# EAGLE schematic 2d (EAGLE 6.4)
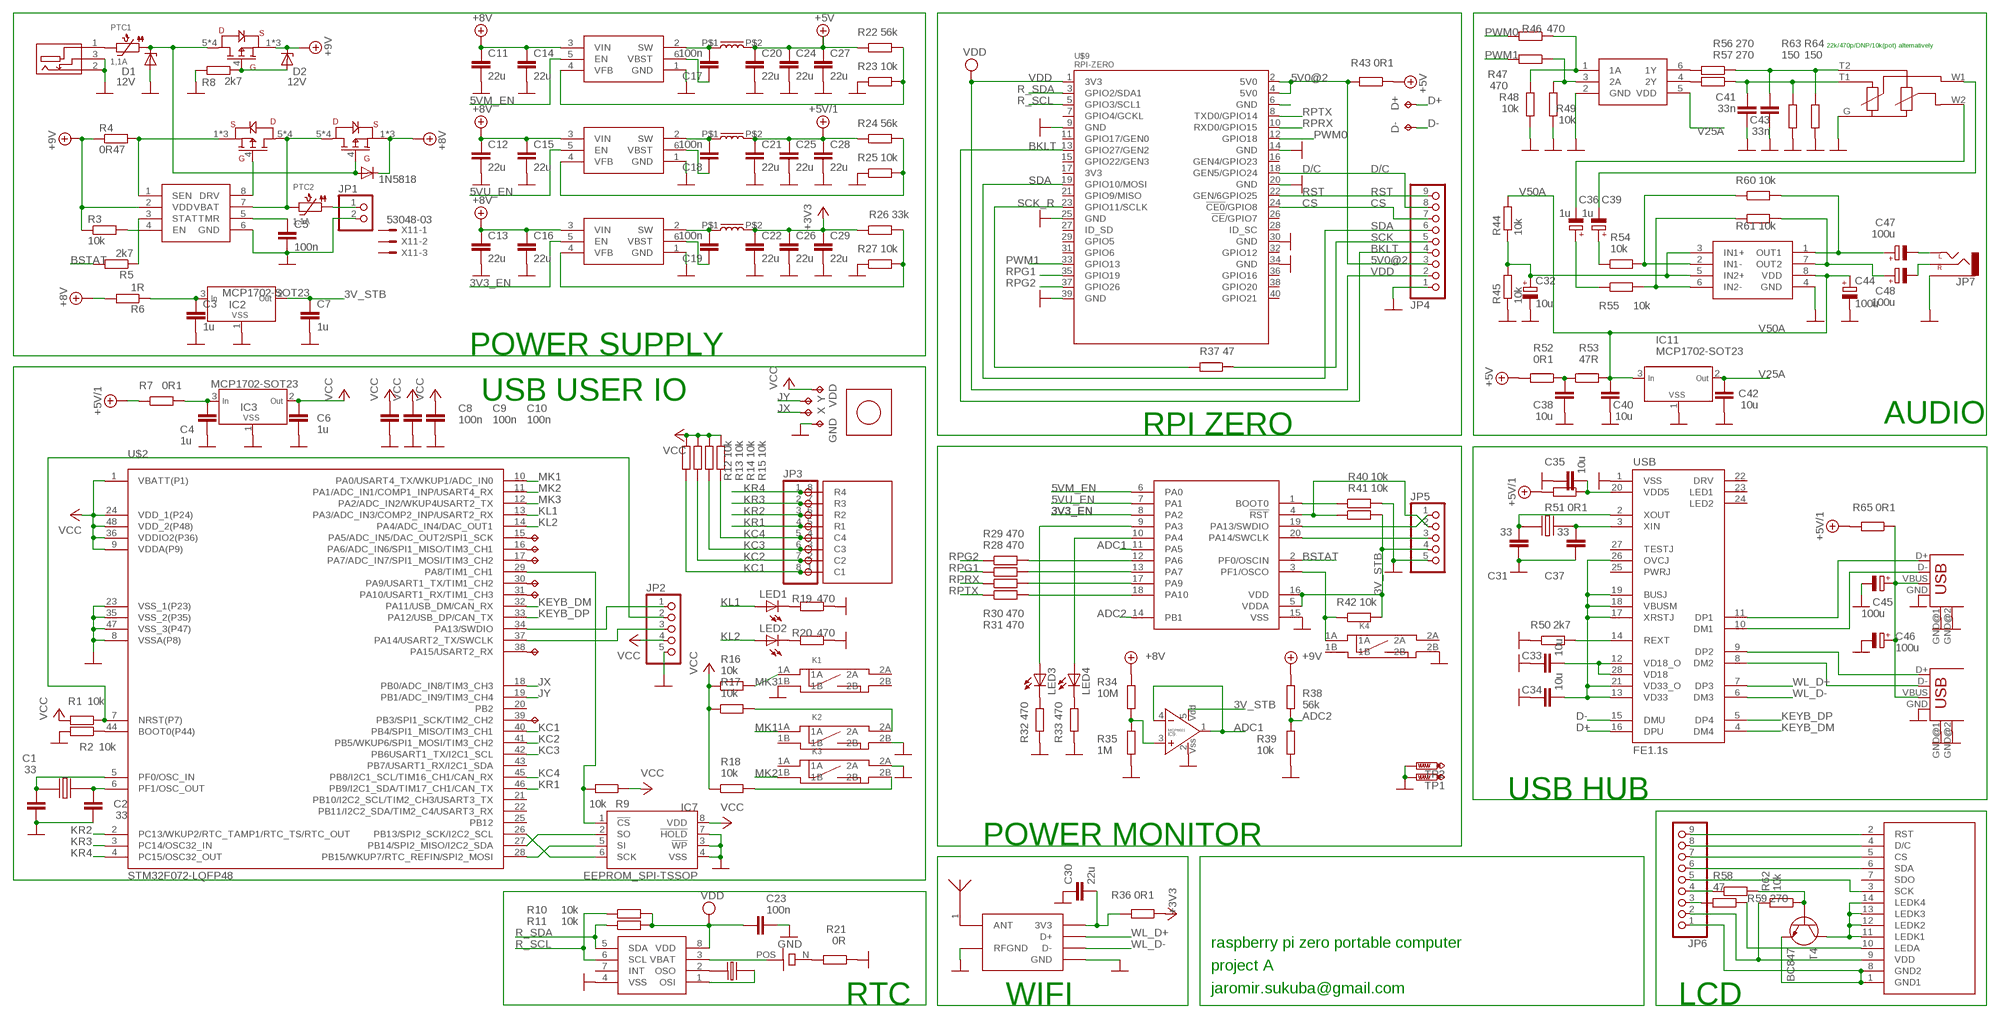
[diagram p0: schematic, sheet 1]

## Parts
ANT1  ANT_RAINSUN_24GHZ  [ANT_RAINSUN-24G]
C1  33  C_0806  [R0805]
C2  33  C_0806  [R0805]
C3  1u  C_0806  [R0805]
C4  1u  C_0806  [R0805]
C5  100n  C_0806  [R0805]
C6  1u  C_0806  [R0805]
C7  1u  C_0806  [R0805]
C8  100n  C_0806  [R0805]
C9  100n  C_0806  [R0805]
C10  100n  C_0806  [R0805]
C11  22u  C_0806  [R0805]
C12  22u  C_0806  [R0805]
C13  22u  C_0806  [R0805]
C14  22u  C_0806  [R0805]
C15  22u  C_0806  [R0805]
C16  22u  C_0806  [R0805]
C17  100n  C_0806  [R0805]
C18  100n  C_0806  [R0805]
C19  100n  C_0806  [R0805]
C20  22u  C_0806  [R0805]
C21  22u  C_0806  [R0805]
C22  22u  C_0806  [R0805]
C23  100n  C_0806  [R0805]
C24  22u  C_0806  [R0805]
C25  22u  C_0806  [R0805]
C26  22u  C_0806  [R0805]
C27  22u  C_0806  [R0805]
C28  22u  C_0806  [R0805]
C29  22u  C_0806  [R0805]
C30  22u  C_0806  [R0805]
C31  33  C_0806  [R0805]
C32  10u  CPOL-EUB  [PANASONIC_B]
C33  10u  C_0806  [R0805]
C34  10u  C_0806  [R0805]
C35  10u  C_0806  [R0805]
C36  1u  CPOL-EUA  [PANASONIC_A]
C37  33  C_0806  [R0805]
C38  10u  C_0806  [R0805]
C39  1u  CPOL-EUA  [PANASONIC_A]
C40  10u  C_0806  [R0805]
C41  33n  C_0806  [R0805]
C42  10u  C_0806  [R0805]
C43  33n  C_0806  [R0805]
C44  100u  CPOL-EUD  [PANASONIC_D]
C45  100u  CPOL-EUD  [PANASONIC_D]
C46  100u  CPOL-EUD  [PANASONIC_D]
C47  100u  CPOL-EUD  [PANASONIC_D]
C48  100u  CPOL-EUD  [PANASONIC_D]
D1  12V  ZENER-DIODESMB  [SMB]
D2  12V  ZENER-DIODESOD80C  [SOD80C]
D3  1N5818  DIODE-SMB  [SMB]
D+  TPTP14R  [TP14R]
D-  TPTP14R  [TP14R]
GND  TPTP14R  [TP14R]
IC1  MCP73844  [MSOP8]
IC2  MCP1702-SOT23  [SOT23]
IC3  MCP1702-SOT23  [SOT23]
IC4  TPS562200  [SOT23-6]
IC5  TPS562200  [SOT23-6]
IC6  TPS562200  [SOT23-6]
IC7  EEPROM_SPI-TSSOP  [TSSOP8W]
IC8  PCF8523  [SO-08]
IC9  MCP6021  [SOT23-5L]
IC10  74LVC2G34  [SOT23-6]
IC11  MCP1702-SOT23  [SOT23]
JP1  PINHD-1X02_2.54-90°  [1X02/90]
JP2  PINHD-1X05_2.54-90°  [1X05/90]
JP3  PINHD-1X08_2.54  [1X08]
JP4  PINHD-1X09_2.00  [1X09M]
JP5  PINHD-1X05_2.54-90°  [1X05/90]
JP6  PINHD-1X09_2.00  [1X09M]
JP7  AUDIO-JACKPTH  [AUDIO-JACK]
K1  SWITCH_BD_B  [SW_SMD2]
K2  SWITCH_BD_B  [SW_SMD2]
K3  SWITCH_BD_B  [SW_SMD2]
K4  SWITCH_BD_B  [SW_SMD2]
LED1  LED3MM  [LED3MM]
LED2  LED3MM  [LED3MM]
LED3  LED3MM  [LED3MM]
LED4  LED3MM  [LED3MM]
MOD1  MOD_USB_RTL8188  [MOD_USB_RTL8188]
PTC1  1,1A  PTC1812  [PTC1812]
PTC2  1,1A  PTC1812  [PTC1812]
Q1  CRYSTAL87X38  [CRYST_32K_87X38MM]
R1  10k  R_0805  [R0805]
R2  10k  R_0805  [R0805]
R3  10k  R_0805  [R0805]
R4  0R47  R_1206  [R1206]
R5  2k7  R_0805  [R0805]
R6  1R  R_0805  [R0805]
R7  0R1  R_1206  [R1206]
R8  2k7  R_0805  [R0805]
R9  10k  R_0805  [R0805]
R10  10k  R_0805  [R0805]
R11  10k  R_0805  [R0805]
R12  10k  R_0805  [R0805]
R13  10k  R_0805  [R0805]
R14  10k  R_0805  [R0805]
R15  10k  R_0805  [R0805]
R16  10k  R_0805  [R0805]
R17  10k  R_0805  [R0805]
R18  10k  R_0805  [R0805]
R19  470  R_0805  [R0805]
R20  470  R_0805  [R0805]
R21  0R  R_0805  [R0805]
R22  56k  R_0805  [R0805]
R23  10k  R_0805  [R0805]
R24  56k  R_0805  [R0805]
R25  10k  R_0805  [R0805]
R26  33k  R_0805  [R0805]
R27  10k  R_0805  [R0805]
R28  470  R_0805  [R0805]
R29  470  R_0805  [R0805]
R30  470  R_0805  [R0805]
R31  470  R_0805  [R0805]
R32  470  R_0805  [R0805]
R33  470  R_0805  [R0805]
R34  10M  R_0805  [R0805]
R35  1M  R_0805  [R0805]
R36  0R1  R_1206  [R1206]
R37  47  R_0805  [R0805]
R38  56k  R_0805  [R0805]
R39  10k  R_0805  [R0805]
R40  10k  R_0805  [R0805]
R41  10k  R_0805  [R0805]
R42  10k  R_0805  [R0805]
R43  0R1  R_1206  [R1206]
R44  10k  R_0805  [R0805]
R45  10k  R_0805  [R0805]
R46  470  R_0805  [R0805]
R47  470  R_0805  [R0805]
R48  10k  R_0805  [R0805]
R49  10k  R_0805  [R0805]
R50  2k7  R_0805  [R0805]
R51  0R1  R_1206  [R1206]
R52  0R1  R_1206  [R1206]
R53  47R  R_0805  [R0805]
R54  10k  R_0805  [R0805]
R55  10k  R_0805  [R0805]
R56  270  R_0805  [R0805]
R57  270  R_0805  [R0805]
R58  47  R_0805  [R0805]
R59  270  R_0805  [R0805]
R60  10k  R_0805  [R0805]
R61  10k  R_0805  [R0805]
R62  10k  R_0805  [R0805]
R63  150  R_0805  [R0805]
R64  150  R_0805  [R0805]
R65  0R1  R_1206  [R1206]
T1  PFET_SO8  [SO-08]
T2  PFET_SO8  [SO-08]
T3  PFET_SO8  [SO-08]
T4  BC847  [SOT23]
TFT1  DISP_ILI_28  [DISP_ILI_28]
TP1  PTR1PAD1-13  [P1-13]
TP2  PTR1PAD1-13  [P1-13]
U$1  CONN_DC_13  [CON_DC13]
U$2  STM32F072-LQFP48  [LQFP48]
U$3  2u2  INDUCTORBOURNS_SRP7030  [BOURNS_SRP7030]
U$4  2u2  INDUCTORBOURNS_SRP7030  [BOURNS_SRP7030]
U$5  2u2  INDUCTORBOURNS_SRP7030  [BOURNS_SRP7030]
U$6  BATTH1220  [BATT_HOLDER_DS1092-12]
U$7  KB1604  [KB1604]
U$8  JOY_PS  [JOY_PS]
U$9  RPI-ZERO  [RASPBERRYPI_BASTELSTUBE_V13_RASPI_BOARD_B+_FULL]
U$10  STM32F030_20  [TSSOP20]
U$11  TDA1308  [SO-08]
U$12  POT_DUAL_14X2  [POT_14X2DUAL]
USB  FE1.1S  [FE1.1S_SSOP-28]
USB1  USB-A-S  [USB-A-S]
USB2  USB-A-S  [USB-A-S]
VDD  TPTP14R  [TP14R]
X  TPTP14R  [TP14R]
X1  CRYST_TC26SMXAS  [CR_12SMXA_S]
X2  TPTP14R  [TP14R]
X3  TPTP14R  [TP14R]
X4  TPTP14R  [TP14R]
X5  TPTP14R  [TP14R]
X6  TPTP14R  [TP14R]
X7  TPTP14R  [TP14R]
X8  TPTP14R  [TP14R]
X9  CRYST_TC26SMXAS  [CR_12SMXA_S]
X11  53048-03  [53048-03]
Y  TPTP14R  [TP14R]

## Nets
3V3_EN: IC6.5(EN) U$10.8(PA2)
3V_STB: C7.1 IC2.2(OUT) IC9.5(VDD) JP5.4 R41.2 R42.2 U$10.5(VDDA) U$10.16(VDD)
5V0@2: JP4.3 R43.2 U$9.2(5V0) U$9.4(5V0)
5VM_EN: IC4.5(EN) U$10.6(PA0)
5VU_EN: IC5.5(EN) U$10.7(PA1)
+3V3: C22.1 C26.1 C29.1 R26.1 R36.1 U$5.P$2
+5V: C20.1 C24.1 C27.1 R22.1 R43.1 R52.2 U$3.P$2
+5V/1: C21.1 C25.1 C28.1 R7.1 R24.1 R51.2 R65.2 U$4.P$2
+8V: C11.1 C12.1 C13.1 C14.1 C15.1 C16.1 D3.C IC4.3(VIN) IC5.3(VIN) IC6.3(VIN) R6.2 R34.2 T3.1(S) T3.2(S) T3.3(S)
+12V: D2.C IC1.2(VDD) R3.1 R4.1 R38.2 T1.1(S) T1.2(S) T1.3(S) ; supply symbol labelled +9V
ADC1: IC9.1(.:VYSTUP) IC9.4(.:IN-) U$10.11(PA5)
ADC2: R38.1 R39.2 U$10.14(PB1)
BKLT: JP4.4 U$9.13(GPIO27/GEN2)
BSTAT: R5.2 U$10.2(PF0/OSCIN)
CS: JP4.7 U$9.24(!CE0!/GPIO8)
D+: D+.TP USB.16(DPU)
D-: D-.TP USB.15(DMU)
D/C: JP4.8 U$9.18(GEN5/GPIO24)
GND: C1.1 C2.1 C3.2 C4.2 C5.2 C6.2 C7.2 C8.2 C9.2 C10.2 C11.2 C12.2 C13.2 C14.2 C15.2 C16.2 C20.2 C21.2 C22.2 C23.2 C24.2 C25.2 C26.2 C27.2 C28.2 C29.2 C30.1 C31.1 C32.- C33.1 C34.1 C35.1 C37.1 C38.1 C40.1 C41.1 C42.1 C43.1 C44.- C45.- C46.- D1.A GND.TP IC1.6(GND) IC2.1(VSS) IC3.1(VSS) IC4.1(GND) IC5.1(GND) IC6.1(GND) IC7.3(!WP) IC7.4(VSS) IC7.7(!HOLD) IC8.4(VSS) IC9.2(VSS) IC10.2(GND) IC11.1(VSS) JP1.2 JP2.5 JP4.1 JP5.5 JP7.SLEEVE K1.1B K2.2B K3.2A K4.2B MOD1.GND MOD1.RFGND R2.2 R8.1 R19.1 R20.1 R21.1 R23.1 R25.1 R27.1 R32.1 R33.1 R35.1 R39.1 R40.2 R45.1 R48.1 R49.1 R50.1 R63.2 R64.2 TP1.TP TP2.TP U$1.2(N) U$1.3(SW) U$2.8(VSSA(P8)) U$2.23(VSS_1(P23)) U$2.35(VSS_2(P35)) U$2.47(VSS_3(P47)) U$9.9(GND) U$9.14(GND) U$9.20(GND) U$9.25(GND) U$9.30(GND) U$9.34(GND) U$9.39(GND) U$10.15(VSS) U$11.4(GND) U$12.G USB1.GND USB1.GND@1(GND) USB1.GND@2(GND) USB2.GND USB2.GND@1(GND) USB2.GND@2(GND) USB.1(VSS)
GND@8: U$9.6(GND)
JX: U$2.18(PB0/ADC_IN8/TIM3_CH3) X.TP
JY: U$2.19(PB1/ADC_IN9/TIM3_CH4) Y.TP
KC1: JP3.8 R12.1 U$2.40(PB4/SPI1_MISO/TIM3_CH1) U$7.1(C1)
KC2: JP3.7 R13.1 U$2.41(PB5/WKUP6/SPI1_MOSI/TIM3_CH2) U$7.2(C2)
KC3: JP3.6 R14.1 U$2.42(PB6USART1_TX/I2C1_SCL) U$7.3(C3)
KC4: JP3.5 R15.1 U$2.45(PB8/I2C1_SCL/TIM16_CH1/CAN_RX) U$7.4(C4)
KEYB_DM: U$2.32(PA11/USB_DM/CAN_RX) USB.4(DM4)
KEYB_DP: U$2.33(PA12/USB_DP/CAN_TX) USB.5(DP4)
KL1: LED1.A U$2.13(PA3/ADC_IN3/COMP2_INP/USART2_RX)
KL2: LED2.A U$2.14(PA4/ADC_IN4/DAC_OUT1)
KR1: JP3.4 U$2.46(PB9/I2C1_SDA/TIM17_CH1/CAN_TX) U$7.5(R1)
KR2: JP3.3 U$2.2(PC13/WKUP2/RTC_TAMP1/RTC_TS/RTC_OUT) U$7.6(R2)
KR3: JP3.2 U$2.3(PC14/OSC32_IN) U$7.7(R3)
KR4: JP3.1 U$2.4(PC15/OSC32_OUT) U$7.8(R4)
MK1: K2.1A U$2.10(PA0/USART4_TX/WKUP1/ADC_IN0)
MK2: K3.1B U$2.11(PA1/ADC_IN1/COMP1_INP/USART4_RX)
MK3: K1.1A R16.2 U$2.12(PA2/ADC_IN2/WKUP4USART2_TX)
N$2: C35.2 R51.1 USB.20(VDD5)
N$3: C17.2 IC4.2(SW) U$3.P$1
N$5: JP6.3 R58.2
N$6: IC7.6(SCK) U$2.26(PB13/SPI2_SCK/I2C2_SCL)
N$7: R59.2 R62.1 T4.1(B)
N$8: JP6.4 R59.1
N$9: IC1.1(SEN) R4.2 T2.1(S) T2.2(S) T2.3(S)
N$10: USB2.D+ USB.9(DP2)
N$11: USB2.D- USB.8(DM2)
N$12: USB1.D- USB.10(DM1)
N$13: IC1.8(DRV) T2.4(G)
N$14: IC1.4(EN) R3.2
N$15: USB1.D+ USB.11(DP1)
N$16: C34.2 USB.13(VD33) USB.17(XRSTJ) USB.18(VBUSM) USB.19(BUSJ) USB.21(VD33_O) USB.26(OVCJ)
N$17: IC1.7(VBAT) PTC2.P$2 T2.5(D) T2.6(D) T2.7(D) T2.8(D) T3.5(D) T3.6(D) T3.7(D) T3.8(D)
N$18: C33.2 USB.12(VD18_O) USB.28(VD18)
N$19: C5.1 IC1.5(TMR)
N$20: C17.1 IC4.6(VBST)
N$21: R50.2 USB.14(REXT)
N$22: IC4.4(VFB) R22.2 R23.2
N$23: C31.2 USB.2(XOUT) X9.P$1
N$24: C18.2 IC5.2(SW) U$4.P$1
N$25: C18.1 IC5.6(VBST)
N$26: C37.2 USB.3(XIN) X9.P$2
N$27: C45.+ C46.+ R65.1 USB1.VBUS USB2.VBUS
N$28: IC7.2(SO) U$2.27(PB14/SPI2_MISO/I2C2_SDA)
N$30: IC10.6(1Y) R56.2
N$31: IC10.4(2Y) R57.2
N$32: C43.2 R56.1 R64.1 U$12.T2
N$33: C41.2 R57.1 R63.1 U$12.T1
N$34: C47.- JP7.TIP(LEFT)
N$35: C48.- JP7.RING(RIGHT)
N$36: C47.+ R60.2 U$11.1(OUT1)
N$37: C48.+ R61.2 U$11.7(OUT2)
N$38: C32.+ R44.1 R45.2 U$11.3(IN1+) U$11.5(IN2+)
N$39: R54.2 R60.1 U$11.2(IN1-)
N$40: R55.2 R61.1 U$11.6(IN2-)
N$41: C39.+ R54.1
N$42: C36.+ R55.1
N$43: C36.- U$12.W2
N$44: C39.- U$12.W1
N$46: ANT1.1 MOD1.ANT
N$47: C38.2 R52.1 R53.1
N$48: IC5.4(VFB) R24.2 R25.2
N$49: C19.2 IC6.2(SW) U$5.P$1
N$50: C19.1 IC6.6(VBST)
N$51: JP2.1 U$2.34(PA13/SWDIO)
N$53: IC6.4(VFB) R26.2 R27.2
N$54: C4.1 IC3.3(IN) R7.2
N$55: JP2.3 U$2.37(PA14/USART2_TX/SWCLK)
N$57: D2.A R8.2 T1.4(G)
N$58: PTC1.P$2 U$1.1(P)
N$59: IC10.1(1A) R46.1 R48.2
N$60: IC10.3(2A) R47.1 R49.2
N$62: C1.2 U$2.5(PF0/OSC_IN) X1.P$1
N$64: U$2.30(PA9/USART1_TX/TIM1_CH2) X5.TP
N$65: IC7.5(SI) U$2.28(PB15/WKUP7/RTC_REFIN/SPI2_MOSI)
N$66: IC7.1(!CS) R9.2 U$2.29(PA8/TIM1_CH1)
N$67: U$2.31(PA10/USART1_RX/TIM1_CH3) X6.TP
N$68: U$2.15(PA5/ADC_IN5/DAC_OUT2/SPI1_SCK) X2.TP
N$69: R2.1 U$2.44(BOOT0(P44))
N$70: LED1.K(C) R19.2
N$71: LED2.K(C) R20.2
N$72: LED4.A U$10.10(PA4)
N$73: LED3.A U$10.9(PA3)
N$74: JP2.2 R1.1 U$2.7(NRST(P7))
N$75: R30.2 U$10.17(PA9)
N$76: R31.2 U$10.18(PA10)
N$77: R28.2 U$10.13(PA7)
N$78: R29.2 U$10.12(PA6)
N$79: U$2.16(PA6/ADC_IN6/SPI1_MISO/TIM3_CH1) X3.TP
N$80: U$2.17(PA7/ADC_IN7/SPI1_MOSI/TIM3_CH2) X4.TP
N$81: U$2.38(PA15/USART2_RX) X7.TP
N$82: U$2.39(PB3/SPI1_SCK/TIM2_CH2) X8.TP
N$83: JP5.1 U$10.19(PA13/SWDIO)
N$84: JP5.3 U$10.20(PA14/SWCLK)
N$85: JP5.2 R41.1 U$10.4(!RST)
N$86: JP1.1 PTC2.P$1
N$89: K4.1A R42.1 U$10.3(PF1/OSCO)
N$90: C2.2 U$2.6(PF1/OSC_OUT) X1.P$2
N$92: IC8.3(VBAT) U$6.POS(P)
N$94: R21.2 U$6.N(M)
N$95: LED3.K(C) R32.2
N$96: LED4.K(C) R33.2
N$97: K3.2B R18.2
N$98: IC8.2(OSO) Q1.4
N$99: IC8.1(OSI) Q1.1
N$100: K2.2A R17.2
N$103: JP6.5 TFT1.3(SCK)
N$106: T4.3(C) TFT1.11(LEDK1) TFT1.12(LEDK2) TFT1.13(LEDK3) TFT1.14(LEDK4)
N$108: IC1.3(STAT) R5.1
N$110: C30.2 MOD1.3V3 R36.2
N$111: IC9.3(.:NEIN+) R34.1 R35.2
N$112: C3.1 IC2.3(IN) R6.1
N$113: R40.1 U$10.1(BOOT0)
N$114: D1.C D3.A PTC1.P$1 T1.5(D) T1.6(D) T1.7(D) T1.8(D) T3.4(G)
N$115: R58.1 TFT1.10(LEDA)
N$116: JP6.2 R62.2 TFT1.9(VDD)
N$117: JP6.1 T4.2(E) TFT1.1(GND1) TFT1.8(GND2)
N$118: JP6.6 TFT1.6(SDA)
N$119: JP6.7 TFT1.5(CS)
N$120: JP6.8 TFT1.4(D/C)
N$121: JP6.9 TFT1.2(RST)
PWM0: R47.2 U$9.12(GPIO18)
PWM1: R46.2 U$9.33(GPIO13)
R_SCL: IC8.6(SCL) R10.1 U$9.5(GPIO3/SCL1)
R_SDA: IC8.5(SDA) R11.1 U$9.3(GPIO2/SDA1)
RPG1: R28.1 U$9.35(GPIO19)
RPG2: R29.1 U$9.37(GPIO26)
RPRX: R30.1 U$9.10(RXD0/GPIO15)
RPTX: R31.1 U$9.8(TXD0/GPIO14)
RST: JP4.9 U$9.22(GEN/6GPIO25)
SCK: JP4.5 R37.1
SCK_R: R37.2 U$9.23(GPIO11/SCLK)
SDA: JP4.6 U$9.19(GPIO10/MOSI)
V25A: C42.2 IC10.5(VDD) IC11.2(OUT)
V50A: C40.2 C44.+ IC11.3(IN) R44.2 R53.2 U$11.8(VDD)
VCC: C6.1 C8.1 C9.1 C10.1 IC3.2(OUT) IC7.8(VDD) JP2.4 R1.2 R9.1 R12.2 R13.2 R14.2 R15.2 R16.1 R17.1 R18.1 U$2.1(VBATT(P1)) U$2.9(VDDA(P9)) U$2.24(VDD_1(P24)) U$2.36(VDDIO2(P36)) U$2.48(VDD_2(P48)) VDD.TP
VDD: C23.1 IC8.8(VDD) JP4.2 R10.2 R11.2 U$9.1(3V3)
WL_D+: MOD1.D+ USB.7(DP3)
WL_D-: MOD1.D- USB.6(DM3)
Unconnected: IC8.7(INT) K1.2A K1.2B K2.1B K3.1A K4.1B K4.2A TFT1.7(SDO) U$2.20(PB2) U$2.21(PB10/I2C2_SCL/TIM2_CH3/USART3_TX) U$2.22(PB11/I2C2_SDA/TIM2_C4/USART3_RX) U$2.25(PB12) U$2.43(PB7/USART1_RX/I2C1_SDA) U$9.7(GPIO4/GCKL) U$9.11(GPIO17/GEN0) U$9.15(GPIO22/GEN3) U$9.16(GEN4/GPIO23) U$9.17(3V3) U$9.21(GPIO9/MISO) U$9.26(!CE!/GPIO7) U$9.27(ID_SD) U$9.28(ID_SC) U$9.29(GPIO5) U$9.31(GPIO6) U$9.32(GPIO12) U$9.36(GPIO16) U$9.38(GPIO20) U$9.40(GPIO21) USB.22(DRV) USB.23(LED1) USB.24(LED2) USB.25(PWRJ) USB.27(TESTJ) X11.1 X11.2 X11.3

## Notes on the sheet
- 22k/470p/DNP/10k(pot) alternatively
- POWER SUPPLY
- USB USER IO
- AUDIO
- RPI ZERO
- USB HUB
- POWER MONITOR
- raspberry pi zero portable computer
- project A
- jaromir.sukuba@gmail.com
- RTC | WIFI | LCD

## Library data of the parts
ANT1 = _moja:ANT_RAINSUN_24GHZ
C1-C31 C33-C35 C37 C38 C40-C43 = _moja:C
C32 C36 C39 C44-C48 = _rcl:CPOL-EU: POLARIZED CAPACITOR, European symbol
D1 D2 = diode:ZENER-DIODE: Z-Diode
D3 = diode:DIODE-: DIODE
D+ D- GND VDD X X2-X8 Y = testpad:TP: Test pad
IC1 = _mcom6:MCP73844
IC2 IC3 IC11 = _mcom6:MCP1702
IC4-IC6 = _mcom6:TPS562200
IC7 = _mcom6:EEPROM_SPI
IC8 = _mcom6:PCF8523
IC9 = _mcom6:MCP6021
IC10 = _mcom6:74LVC2G34
JP1 = pinhead-2:PINHD-1X02: PIN HEADER
JP2 JP5 = pinhead-2:PINHD-1X05: PIN HEADER
JP3 = pinhead-2:PINHD-1X08: PIN HEADER
JP4 JP6 = pinhead-2:PINHD-1X09: PIN HEADER
JP7 = SparkFun-Connectors:AUDIO-JACK: 3.5mm Audio Jack Simple 3.5mm common PCB mount audio jack. SKU: PRT-08032
K1-K4 = _moja:SWITCH_BD
LED1-LED4 = led:LED: LED OSRAM: - CHIPLED LG R971, LG N971, LY N971, LG Q971, LY Q971, LO R971, LY R971 LH N974, LH R974 LS Q976, LO Q976, LY Q976 LO Q996 - Hyper CHIPLED LW Q18S LB Q993, LB Q99A, LB R99A - SideLED LS A670, LO A670, LY A670, LG A670, LP A670 LB A673, LV A673, LT A673, LW A673 LH A674 LY A675 LS A676, LA A676, LO A676, LY A676, LW A676 LS A679, LY A679, LG A679 - Hyper Micro SIDELED® LS Y876, LA Y876, LO Y876, LY Y876 LT Y87S - SmartLED LW L88C, LW L88S LB L89C, LB L89S, LG L890 LS L89K, LO L89K, LY L89K LS L896, LA L896, LO L896, LY L896 - TOPLED LS T670, LO T670, LY T670, LG T670, LP T670 LSG T670, LSP T670, LSY T670, LOP T670, LYG T670 LG T671, LOG T671, LSG T671 LB T673, LV T673, LT T673, LW T673 LH T674 LS T676, LA T676, LO T676, LY T676, LB T676, LH T676, LSB T676, LW T676 LB T67C, LV T67C, LT T67C, LS T67K, LO T67K, LY T67K, LW E67C LS E67B, LA E67B, LO E67B, LY E67B, LB E67C, LV E67C, LT E67C LW T67C LS T679, LY T679, LG T679 LS T770, LO T770, LY T770, LG T770, LP T770 LB T773, LV T773, LT T773, LW T773 LH T774 LS E675, LA E675, LY E675, LS T675 LS T776, LA T776, LO T776, LY T776, LB T776 LHGB T686 LT T68C, LB T68C - Hyper Mini TOPLED® LB M676 - Mini TOPLED Santana® LG M470 LS M47K, LO M47K, LY M47K Source: http://www.osram.convergy.de LUXEON: - LUMILED® LXK2-PW12-R00, LXK2-PW12-S00, LXK2-PW14-U00, LXK2-PW14-V00 LXK2-PM12-R00, LXK2-PM12-S00, LXK2-PM14-U00 LXK2-PE12-Q00, LXK2-PE12-R00, LXK2-PE12-S00, LXK2-PE14-T00, LXK2-PE14-U00 LXK2-PB12-K00, LXK2-PB12-L00, LXK2-PB12-M00, LXK2-PB14-N00, LXK2-PB14-P00, LXK2-PB14-Q00 LXK2-PR12-L00, LXK2-PR12-M00, LXK2-PR14-Q00, LXK2-PR14-R00 LXK2-PD12-Q00, LXK2-PD12-R00, LXK2-PD12-S00 LXK2-PH12-R00, LXK2-PH12-S00 LXK2-PL12-P00, LXK2-PL12-Q00, LXK2-PL12-R00 Source: www.luxeon.com KINGBRIGHT: KA-3528ASYC Source: www.kingbright.com
MOD1 = _moja:MOD_USB_RTL8188
PTC1 PTC2 = _microbuilder:PTC: PTC (Resettable Fuse) 1206 Package 250mA PTC (16V Max, Time-to-Trip: 0.08s) - Digikey: F2110CT-ND 1210 Package 100mA PTC (30V Max, Time-to-Trip: 0.6s) - Digikey: MF-USMF010-2CT-ND 1812 Package 750mA PTC (24V Max, Time-to-Trip: 0.2s) - Digikey: MF-MSMF075/24-2CT-ND
Q1 = _mcom6:CRYSTAL
R1-R65 = _moja:R
T1-T3 = _mcom6:PFET_SO8
T4 = _mcom6:BC847
TFT1 = _moja:DISP_ILI_28
TP1 TP2 = testpad:PTR1: TEST PIN
U$1 = _moja:CONN_DC_13
U$2 = stm32f0:STM32F072
U$3-U$5 = _mcs1:INDUCTOR
U$6 = _moja:BATT
U$7 = _moja:KB1604
U$8 = _moja:JOY_PS
U$9 = RPI-Zero:RPI-ZERO
U$10 = _jl4:STM32F030_20: valid for STM32f030, STM32F031 in TSSOP20
U$11 = _mcom6:TDA1308
U$12 = _moja:POT_DUAL_14X2
USB = imcom:FE1.1S: A USB 2.0 hub IC. http://www.jfd-ic.com/Documents/FE1.1s%20Data%20Sheet%20%28Rev.%201.0%29.pdf
USB1 USB2 = con-usb-2:USB: USB Connectors
X1 X9 = _moja:CRYST_TC26
X11 = con-molex:53?-03: CONNECTOR wire to board 1.25 mm (.049 inch) pitch header; MF: WALDOM/MOLEX; MPN: 53048-0310; OC_FARNELL: 9732918; OC_NEWARK: 38C9908